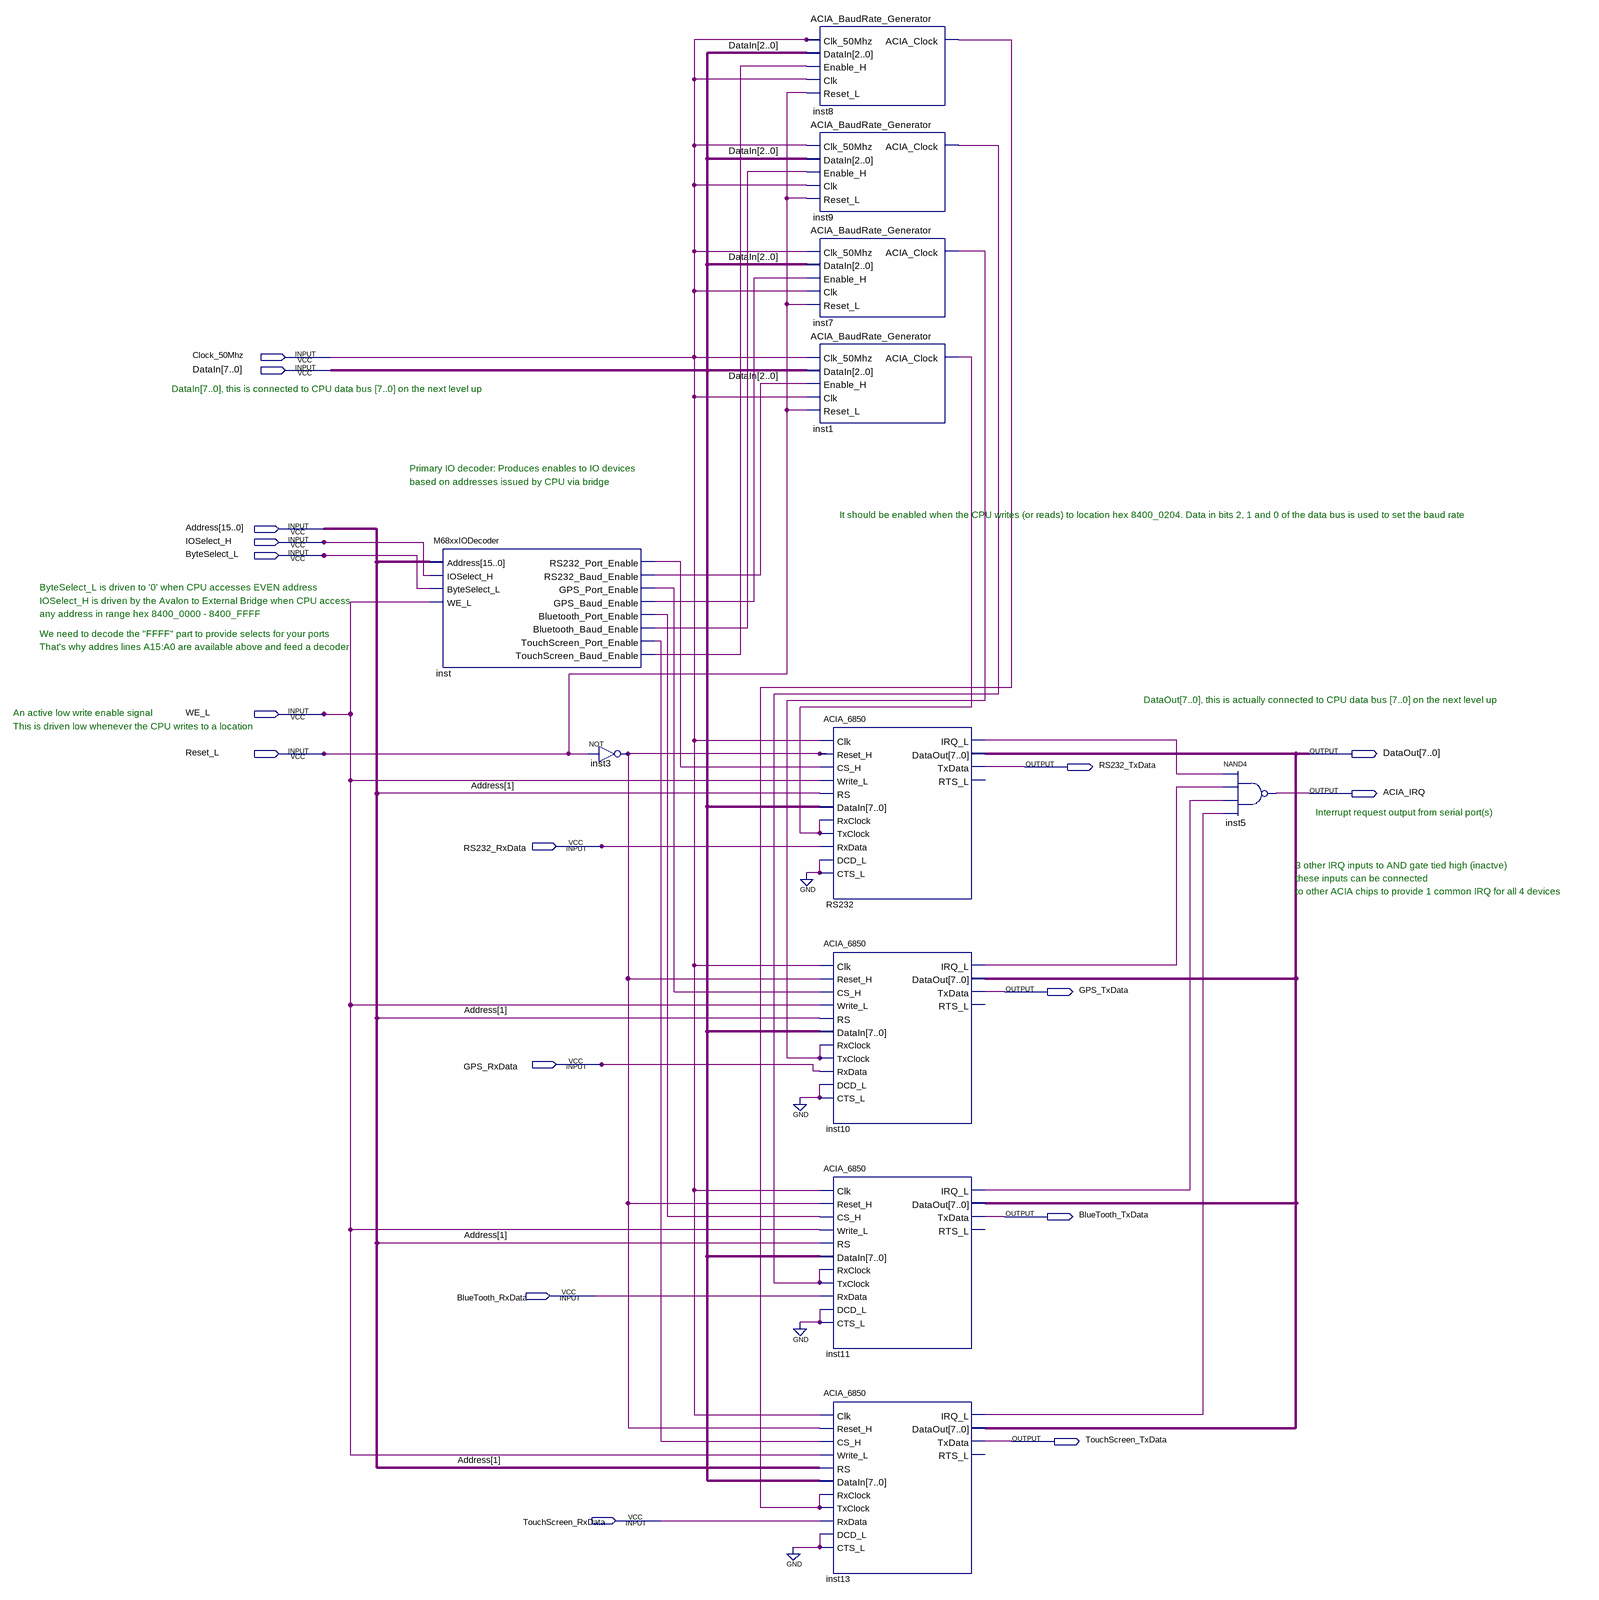
[diagram p0: schematic sheet]
// Quartus schematic OnChipM68xxIO.bdf as structural Verilog: 11 symbols, 17 pins
module OnChipM68xxIO (
  input  Clock_50Mhz,
  input  [7:0] DataIn,
  input  [15:0] Address,
  input  IOSelect_H,
  input  ByteSelect_L,
  input  WE_L,
  input  Reset_L,
  input  RS232_RxData,
  input  GPS_RxData,
  input  BlueTooth_RxData,
  input  TouchScreen_RxData,
  output [7:0] DataOut,
  output RS232_TxData,
  output ACIA_IRQ,
  output GPS_TxData,
  output BlueTooth_TxData,
  output TouchScreen_TxData
);

  wire inst1_acia_clock, inst3_out, inst7_acia_clock, inst8_acia_clock, inst9_acia_clock, inst10_irq_l,
       inst11_irq_l, inst13_irq_l, inst_bluetooth_baud_enable, inst_bluetooth_port_enable,
       inst_gps_baud_enable, inst_gps_port_enable, inst_rs232_baud_enable, inst_rs232_port_enable,
       inst_touchscreen_baud_enable, inst_touchscreen_port_enable, RS232_irq_l;

  M68xxIODecoder inst (
    .Address(Address), .IOSelect_H(IOSelect_H), .ByteSelect_L(ByteSelect_L), .WE_L(WE_L),
    .RS232_Port_Enable(inst_rs232_port_enable), .RS232_Baud_Enable(inst_rs232_baud_enable),
    .GPS_Port_Enable(inst_gps_port_enable), .GPS_Baud_Enable(inst_gps_baud_enable),
    .Bluetooth_Port_Enable(inst_bluetooth_port_enable), .Bluetooth_Baud_Enable(inst_bluetooth_baud_enable),
    .TouchScreen_Port_Enable(inst_touchscreen_port_enable),
    .TouchScreen_Baud_Enable(inst_touchscreen_baud_enable));
  not inst3 (inst3_out, Reset_L);
  ACIA_BaudRate_Generator inst8 (
    .Clk_50Mhz(Clock_50Mhz), .DataIn(DataIn[2:0]), .Enable_H(inst_touchscreen_baud_enable),
    .Clk(Clock_50Mhz), .Reset_L(Reset_L), .ACIA_Clock(inst8_acia_clock));
  ACIA_BaudRate_Generator inst9 (
    .Clk_50Mhz(Clock_50Mhz), .DataIn(DataIn[2:0]), .Enable_H(inst_bluetooth_baud_enable), .Clk(Clock_50Mhz),
    .Reset_L(Reset_L), .ACIA_Clock(inst9_acia_clock));
  ACIA_BaudRate_Generator inst7 (
    .Clk_50Mhz(Clock_50Mhz), .DataIn(DataIn[2:0]), .Enable_H(inst_gps_baud_enable), .Clk(Clock_50Mhz),
    .Reset_L(Reset_L), .ACIA_Clock(inst7_acia_clock));
  ACIA_BaudRate_Generator inst1 (
    .Clk_50Mhz(Clock_50Mhz), .DataIn(DataIn[2:0]), .Enable_H(inst_rs232_baud_enable), .Clk(Clock_50Mhz),
    .Reset_L(Reset_L), .ACIA_Clock(inst1_acia_clock));
  ACIA_6850 RS232 (
    .Clk(Clock_50Mhz), .Reset_H(inst3_out), .CS_H(inst_rs232_port_enable), .Write_L(WE_L), .RS(Address[1]),
    .DataIn(DataIn), .RxClock(inst1_acia_clock), .TxClock(inst1_acia_clock), .RxData(RS232_RxData),
    .DCD_L(1'b0), .CTS_L(1'b0), .IRQ_L(RS232_irq_l), .DataOut(DataOut), .TxData(RS232_TxData));  // open: RTS_L
  ACIA_6850 inst10 (
    .Clk(Clock_50Mhz), .Reset_H(inst3_out), .CS_H(inst_gps_port_enable), .Write_L(WE_L), .RS(Address[1]),
    .DataIn(DataIn), .RxClock(inst7_acia_clock), .TxClock(inst7_acia_clock), .RxData(GPS_RxData),
    .DCD_L(1'b0), .CTS_L(1'b0), .IRQ_L(inst10_irq_l), .DataOut(DataOut), .TxData(GPS_TxData));  // open: RTS_L
  ACIA_6850 inst11 (
    .Clk(Clock_50Mhz), .Reset_H(inst3_out), .CS_H(inst_bluetooth_port_enable), .Write_L(WE_L),
    .RS(Address[1]), .DataIn(DataIn), .RxClock(inst9_acia_clock), .TxClock(inst9_acia_clock),
    .RxData(BlueTooth_RxData), .DCD_L(1'b0), .CTS_L(1'b0), .IRQ_L(inst11_irq_l), .DataOut(DataOut),
    .TxData(BlueTooth_TxData));  // open: RTS_L
  ACIA_6850 inst13 (
    .Clk(Clock_50Mhz), .Reset_H(inst3_out), .CS_H(inst_touchscreen_port_enable), .Write_L(WE_L),
    .RS(Address[1]), .DataIn(DataIn), .RxClock(inst8_acia_clock), .TxClock(inst8_acia_clock),
    .RxData(TouchScreen_RxData), .DCD_L(1'b0), .CTS_L(1'b0), .IRQ_L(inst13_irq_l), .DataOut(DataOut),
    .TxData(TouchScreen_TxData));  // open: RTS_L
  nand inst5 (ACIA_IRQ, RS232_irq_l, inst10_irq_l, inst11_irq_l, inst13_irq_l);

  // Notes on the sheet:
  //   DataIn[7..0], this is connected to CPU data bus [7..0] on the next level up
  //   Primary IO decoder: Produces enables to IO devices
  //   based on addresses issued by CPU via bridge
  //   It should be enabled when the CPU writes (or reads) to location hex 8400_0204. Data in bits 2, 1 and 0 of the data bus is used to set the baud rate
  //   ByteSelect_L is driven to '0' when CPU accesses EVEN address
  //   IOSelect_H is driven by the Avalon to External Bridge when CPU access
  //   any address in range hex 8400_0000 - 8400_FFFF
  //   We need to decode the "FFFF" part to provide selects for your ports 
  //   That's why addres lines A15:A0 are available above and feed a decoder
  //   DataOut[7..0], this is actually connected to CPU data bus [7..0] on the next level up
  //   An active low write enable signal
  //   This is driven low whenever the CPU writes to a location
  //   Interrupt request output from serial port(s)
  //   3 other IRQ inputs to AND gate tied high (inactve)
  //   these inputs can be connected
  //   to other ACIA chips to provide 1 common IRQ for all 4 devices
endmodule
